# EAGLE design pocketbeagle_USB_hub_wifi (EAGLE 7.6.0)
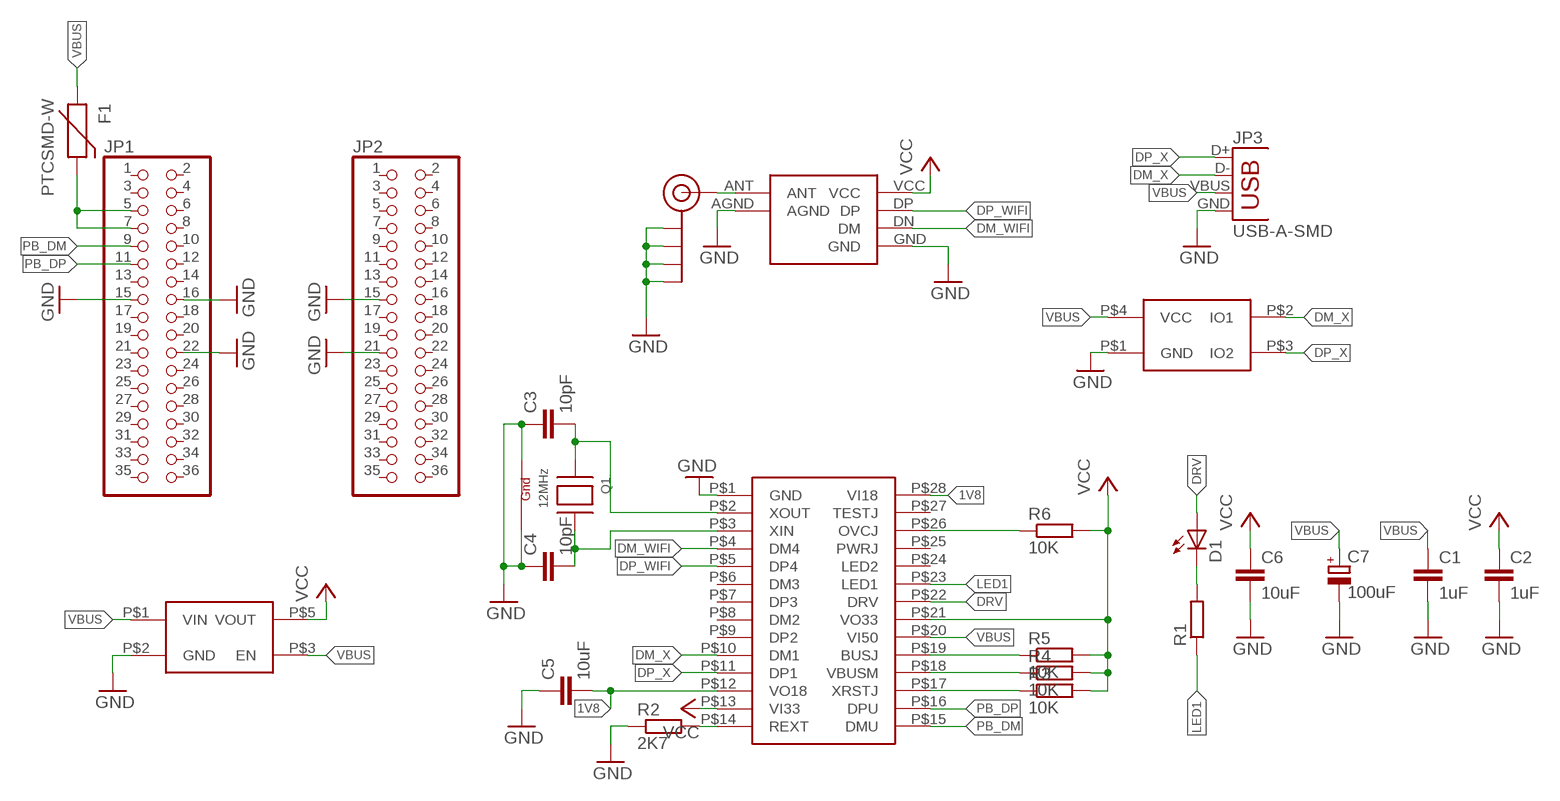
[diagram p0: schematic, sheet 1]

## Parts
C1  1uF  C-EUONEFITSALL  [ONEFITSALL]
C2  1uF  C-EUONEFITSALL  [ONEFITSALL]
C3  10pF  C-EUC0603  [C0603]
C4  10pF  C-EUC0603  [C0603]
C5  10uF  C-EUONEFITSALL  [ONEFITSALL]
C6  10uF  C-EUONEFITSALL  [ONEFITSALL]
C7  100uF  CPOL-EU153CLV-0605  [153CLV-0605]
D1  LEDCHIP-LED0603  [CHIP-LED0603]
F1  PTCSMD-W  [PTC-1206-WIDE]
J$1  SMA_EDGE  [SMA-EDGE]
JP1  PINHD-2X18  [2X18]
JP2  PINHD-2X18  [2X18]
JP3  USB-A-SMD  [USB-A-S-NOSILK-FEMALE]
Q1  12MHz  XTAL-4-3225  [NX3225]
R1  R-EU_R0603  [R0603]
R2  2K7  R-EU_R0603  [R0603]
R3  10K  R-EU_R0603  [R0603]
R4  10K  R-EU_R0603  [R0603]
R5  10K  R-EU_R0603  [R0603]
R6  10K  R-EU_R0603  [R0603]
U$1  RTL8188MODULE  [RTL8188]
U$2  FE1.1SSSOP28  [FE1.1S]
U$3  AP2112KAP2112K  [AP2112]
U$5  PRTR5V0U2X  [PRTR5V0U2X]

## Nets
1V8: C5.P$2 U$2.P$12(VO18) U$2.P$28(VI18)
DM_WIFI: U$1.DN(DM) U$2.P$4(DM4)
DM_X: JP3.D- U$2.P$10(DM1) U$5.P$2(IO1)
DP_WIFI: U$1.DP U$2.P$5(DP4)
DP_X: JP3.D+ U$2.P$11(DP1) U$5.P$3(IO2)
DRV: D1.A U$2.P$22(DRV)
GND: C1.P$2 C2.P$2 C3.1 C4.1 C5.P$1 C6.P$2 C7.- J$1.GND@0(GND) J$1.GND@1(GND) J$1.GND@2(GND) J$1.GND@3(GND) JP1.15 JP1.16 JP1.22 JP2.15 JP2.21 JP3.GND Q1.2(G2) Q1.4(G1) R2.1 U$1.AGND U$1.GND U$2.P$1(GND) U$3.P$2(GND) U$5.P$1(GND)
LED1: R1.1 U$2.P$23(LED1)
N$1: J$1.SIG(SIGNAL) U$1.ANT
N$2: D1.C R1.2
N$3: R3.1 U$2.P$17(XRSTJ)
N$4: C3.2 Q1.1(X1) U$2.P$2(XOUT)
N$5: R4.1 U$2.P$18(VBUSM)
N$6: C4.2 Q1.3(X2) U$2.P$3(XIN)
N$7: R2.2 U$2.P$14(REXT)
N$8: R5.1 U$2.P$19(BUSJ)
N$10: R6.1 U$2.P$26(OVCJ)
PB_DM: JP1.9 U$2.P$15(DMU)
PB_DP: JP1.11 U$2.P$16(DPU)
PB_VBUS: F1.2 JP1.5 JP1.7
VBUS: C1.P$1 C7.+ F1.1 JP3.VBUS U$2.P$20(VI50) U$3.P$1(VIN) U$3.P$3(EN) U$5.P$4(VCC)
VCC: C2.P$1 C6.P$1 R3.2 R4.2 R5.2 R6.2 U$1.VCC U$2.P$13(VI33) U$2.P$21(VO33) U$3.P$5(VOUT)
Unconnected: JP1.1 JP1.2 JP1.3 JP1.4 JP1.6 JP1.8 JP1.10 JP1.12 JP1.13 JP1.14 JP1.17 JP1.18 JP1.19 JP1.20 JP1.21 JP1.23 JP1.24 JP1.25 JP1.26 JP1.27 JP1.28 JP1.29 JP1.30 JP1.31 JP1.32 JP1.33 JP1.34 JP1.35 JP1.36 JP2.1 JP2.2 JP2.3 JP2.4 JP2.5 JP2.6 JP2.7 JP2.8 JP2.9 JP2.10 JP2.11 JP2.12 JP2.13 JP2.14 JP2.16 JP2.17 JP2.18 JP2.19 JP2.20 JP2.22 JP2.23 JP2.24 JP2.25 JP2.26 JP2.27 JP2.28 JP2.29 JP2.30 JP2.31 JP2.32 JP2.33 JP2.34 JP2.35 JP2.36 U$2.P$6(DM3) U$2.P$7(DP3) U$2.P$8(DM2) U$2.P$9(DP2) U$2.P$24(LED2) U$2.P$25(PWRJ) U$2.P$27(TESTJ)

## Library data of the parts
C1-C6 = rcl:C-EU: CAPACITOR, European symbol
C7 = rcl:CPOL-EU: POLARIZED CAPACITOR, European symbol
D1 = led:LED: LED OSRAM: - CHIPLED LG R971, LG N971, LY N971, LG Q971, LY Q971, LO R971, LY R971 LH N974, LH R974 LS Q976, LO Q976, LY Q976 LO Q996 - Hyper CHIPLED LW Q18S LB Q993, LB Q99A, LB R99A - SideLED LS A670, LO A670, LY A670, LG A670, LP A670 LB A673, LV A673, LT A673, LW A673 LH A674 LY A675 LS A676, LA A676, LO A676, LY A676, LW A676 LS A679, LY A679, LG A679 - Hyper Micro SIDELED® LS Y876, LA Y876, LO Y876, LY Y876 LT Y87S - SmartLED LW L88C, LW L88S LB L89C, LB L89S, LG L890 LS L89K, LO L89K, LY L89K LS L896, LA L896, LO L896, LY L896 - TOPLED LS T670, LO T670, LY T670, LG T670, LP T670 LSG T670, LSP T670, LSY T670, LOP T670, LYG T670 LG T671, LOG T671, LSG T671 LB T673, LV T673, LT T673, LW T673 LH T674 LS T676, LA T676, LO T676, LY T676, LB T676, LH T676, LSB T676, LW T676 LB T67C, LV T67C, LT T67C, LS T67K, LO T67K, LY T67K, LW E67C LS E67B, LA E67B, LO E67B, LY E67B, LB E67C, LV E67C, LT E67C LW T67C LS T679, LY T679, LG T679 LS T770, LO T770, LY T770, LG T770, LP T770 LB T773, LV T773, LT T773, LW T773 LH T774 LS E675, LA E675, LY E675, LS T675 LS T776, LA T776, LO T776, LY T776, LB T776 LHGB T686 LT T68C, LB T68C - Hyper Mini TOPLED® LB M676 - Mini TOPLED Santana® LG M470 LS M47K, LO M47K, LY M47K Source: http://www.osram.convergy.de LUXEON: - LUMILED® LXK2-PW12-R00, LXK2-PW12-S00, LXK2-PW14-U00, LXK2-PW14-V00 LXK2-PM12-R00, LXK2-PM12-S00, LXK2-PM14-U00 LXK2-PE12-Q00, LXK2-PE12-R00, LXK2-PE12-S00, LXK2-PE14-T00, LXK2-PE14-U00 LXK2-PB12-K00, LXK2-PB12-L00, LXK2-PB12-M00, LXK2-PB14-N00, LXK2-PB14-P00, LXK2-PB14-Q00 LXK2-PR12-L00, LXK2-PR12-M00, LXK2-PR14-Q00, LXK2-PR14-R00 LXK2-PD12-Q00, LXK2-PD12-R00, LXK2-PD12-S00 LXK2-PH12-R00, LXK2-PH12-S00 LXK2-PL12-P00, LXK2-PL12-Q00, LXK2-PL12-R00 Source: www.luxeon.com KINGBRIGHT: KA-3528ASYC Source: www.kingbright.com
F1 = SparkFun-PowerIC:PTC: Resettable Fuse PTC Resettable Fuse. Spark Fun Electronics SKU : COM-08357
J$1 = SparkFun-Connectors:SMA_EDGE: SMA Antenna Connector End launch SMA connector. The paste layer has been removed so that the connector can be hand soldered onto the board after reflow.
JP1 JP2 = pinhead:PINHD-2X18: PIN HEADER
JP3 = SparkFun-Connectors:USB: USB Connectors USB-B-PTH is fully proven SKU : PRT-00139/CONN-08278 USB-miniB is fully proven SKU : PRT-00587 USB-A-PCB is untested. USB-A-H is throughly reviewed, but untested. Spark Fun Electronics SKU : PRT-00437 USB-B-SMT is throughly reviewed, but untested. Needs silkscreen touching up. USB-A-S has not been used/tested USB-MB-H has not been used/tested USB-MICROB has been used. CONN-09505; PROD_ID: CONN-09520
Q1 = adafruit:XTAL-4: Classic 4-pin 3.2 x 2.5mm crystal
R1-R6 = rcl:R-EU_: RESISTOR, European symbol
U$1 = diy-modules:RTL8188
U$2 = pocketbeagle:FE1.1S
U$3 = TPS2113:AP2112K
U$5 = pocketbeagle:PRTR5V0U2X

## Board
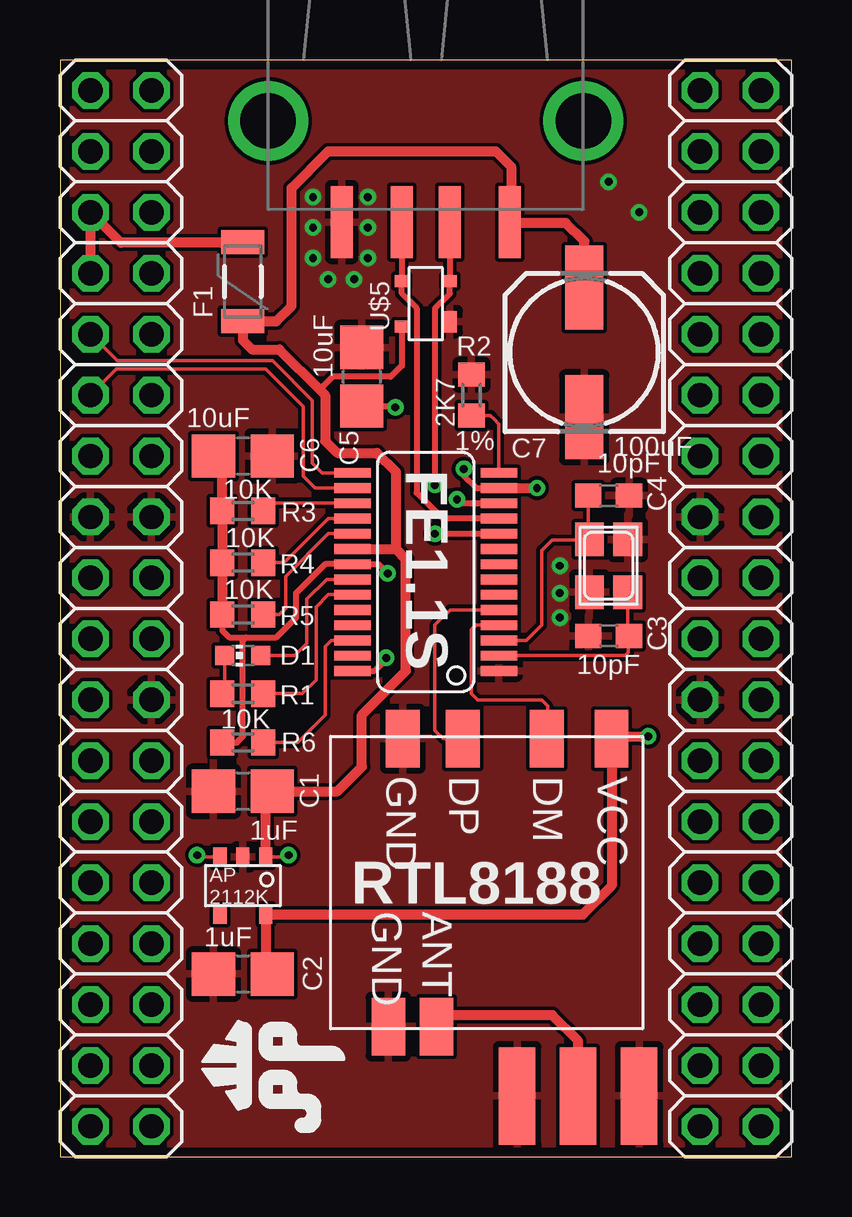
[diagram p1: board, top side]
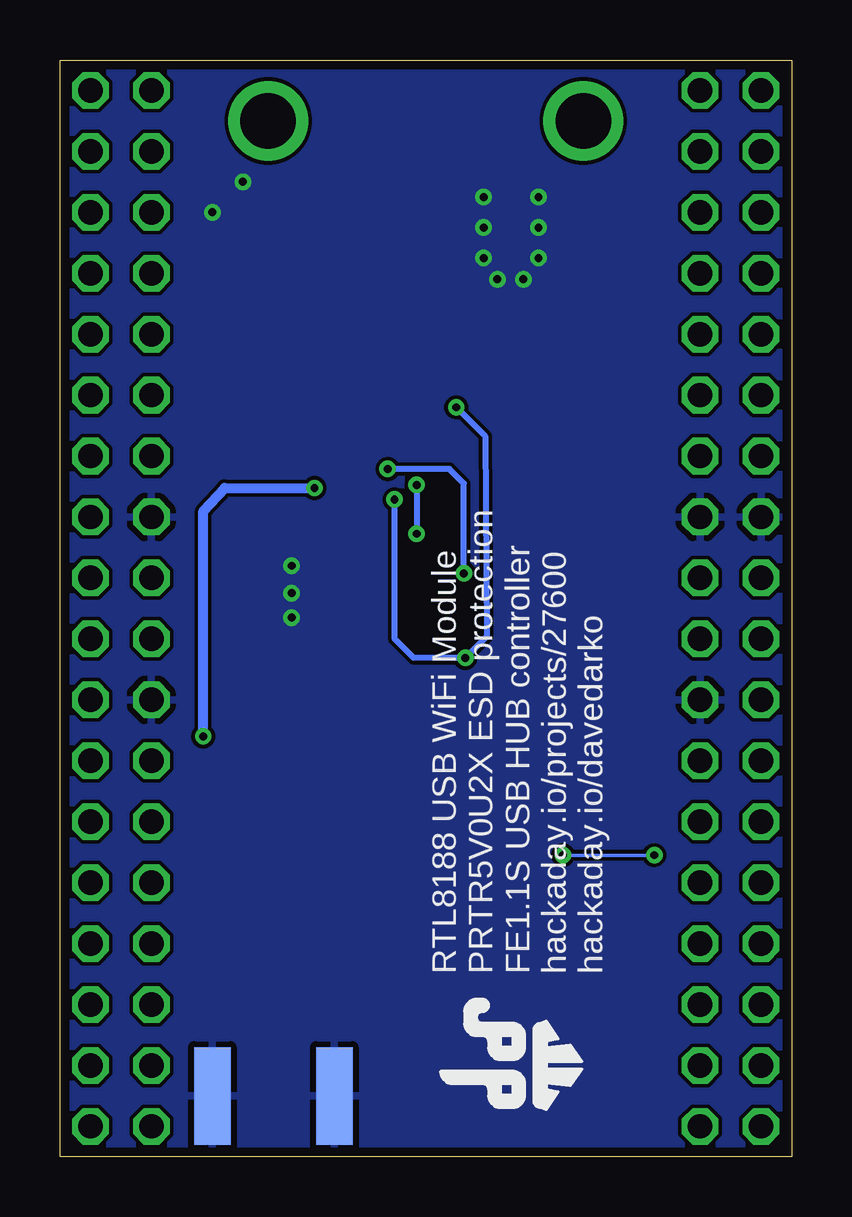
[diagram p2: board, bottom side, seen from below]

Size 30.48 x 45.72 mm. Coordinates in mm from the lower left corner, seen from the top.
Outline: 0,45.72 0,0 30.48,0 30.48,45.72 0,45.72
Copper layers (1*16): Top 0.0356mm / dielectric 1.5011mm / Bottom 0.0356mm
Design rules "LaenPCBOrder *": minimum track width 6mil, minimum drill 13mil, track to track 6mil, track to pad 6mil, pad to pad 6mil, via to via 6mil, smd to smd 6mil, copper to edge 15mil, drill to drill 6mil, minimum pad ring 7mil, minimum via ring 7mil, stop-mask expansion 3mil, vias tented up to drill 200mil, thermal gap 10mil

### Footprints (pad centres in the part's own frame; a part is rotated, then mirrored left to right if it is on the bottom)
ONEFITSALL = smd 1.8 x 1.8: P$1 -1.225,0; P$2 1.225,0
C0603 = smd 1.1 x 1: 1 -0.85,0; 2 0.85,0
153CLV-0605 = smd 3.5 x 1.6: + 2.7,0; - -2.7,0
CHIP-LED0603 = smd 0.8 x 0.8: A 0,-0.75; C 0,0.75
PTC-1206-WIDE = smd 1 x 1.8: 1 -1.654,0; 2 1.654,0
SMA-EDGE = smd 1.524 x 4.064: GND@0 0,0; GND@1 5.08,0; SIG 2.54,0 | smd 1.524 x 4.064 bottom: GND@2 0,0; GND@3 5.08,0
2X18 = drill 1.016 octagon: 1 -21.59,-1.27; 2 -21.59,1.27; 3 -19.05,-1.27; 4 -19.05,1.27; 5 -16.51,-1.27; 6 -16.51,1.27; 7 -13.97,-1.27; 8 -13.97,1.27; 9 -11.43,-1.27; 10 -11.43,1.27; 11 -8.89,-1.27; 12 -8.89,1.27; 13 -6.35,-1.27; 14 -6.35,1.27; 15 -3.81,-1.27; 16 -3.81,1.27; 17 -1.27,-1.27; 18 -1.27,1.27; 19 1.27,-1.27; 20 1.27,1.27; 21 3.81,-1.27; 22 3.81,1.27; 23 6.35,-1.27; 24 6.35,1.27; 25 8.89,-1.27; 26 8.89,1.27; 27 11.43,-1.27; 28 11.43,1.27; 29 13.97,-1.27; 30 13.97,1.27; 31 16.51,-1.27; 32 16.51,1.27; 33 19.05,-1.27; 34 19.05,1.27; 35 21.59,-1.27; 36 21.59,1.27
USB-A-S-NOSILK-FEMALE = smd 3 x 0.9: D+ 4.212,-1; D- 4.212,1; GND 4.212,-3.5; VBUS 4.212,3.5 | drill 2.311: S1 0,-6.566; S2 0,6.566
NX3225 = smd 1.4 x 1.2: 1 -1.1,-0.8; 2 1.1,-0.8; 3 1.1,0.8; 4 -1.1,0.8
R0603 = smd 1 x 1.1: 1 -0.85,0; 2 0.85,0
RTL8188 = smd 2.4 x 1.4: AGND 6,-4.1; ANT 6,-2.1; DN -6,2.5; DP -6,-1; GND -6,-3.5; VCC -6,5.2
FE1.1S = smd 1.524 x 0.406: P$1 -3.048,4.128; P$2 -3.048,3.493; P$3 -3.048,2.857; P$4 -3.048,2.223; P$5 -3.048,1.587; P$6 -3.048,0.953; P$7 -3.048,0.318; P$8 -3.048,-0.318; P$9 -3.048,-0.953; P$10 -3.048,-1.587; P$11 -3.048,-2.223; P$12 -3.048,-2.857; P$13 -3.048,-3.493; P$14 -3.048,-4.128; P$15 3.048,-4.128; P$16 3.048,-3.493; P$17 3.048,-2.857; P$18 3.048,-2.223; P$19 3.048,-1.587; P$20 3.048,-0.953; P$21 3.048,-0.318; P$22 3.048,0.318; P$23 3.048,0.953; P$24 3.048,1.587; P$25 3.048,2.223; P$26 3.048,2.857; P$27 3.048,3.493; P$28 3.048,4.128
AP2112 = smd 0.55 x 0.8: P$1 0.95,1.2; P$2 0,1.2; P$3 -0.95,1.2; P$4 -0.95,-1.2; P$5 0.95,-1.2
PRTR5V0U2X = smd 0.9 x 0.6: P$1 -0.75,-1 | smd 0.5 x 0.6: P$2 0.95,-1; P$3 0.95,1; P$4 -0.95,1

### Placement (x,y rotation side)
C1  7.62,15.24 180 top
C2  7.62,7.62 180 top
C3  22.86,21.72 0 top
C4  22.86,27.56 180 top
C5  12.57,32.51 270 top
C6  7.62,29.21 0 top
C7  21.84,33.53 90 top
D1  7.62,20.89 90 top
F1  7.62,36.48 90 top
J$1  24.13,2.54 180 top
JP1  2.54,22.86 270 top
JP2  27.94,22.86 270 top
JP3  15.24,43.18 270 top
Q1  22.86,24.64 90 top
R1  7.62,19.3 180 top
R2  17.14,31.75 270 top
R3  7.62,26.92 180 top
R4  7.62,24.77 180 top
R5  7.62,22.61 180 top
R6  7.62,17.27 180 top
U$1  17.78,11.43 270 top
U$2  15.24,24.38 180 top
U$3  7.62,11.3 0 top
U$4  [DAVEDARKO2_LOGO]  8.13,3.81 270 top
U$5  15.24,35.56 90 top
U$6  [DAVEDARKO2_LOGO]  10.92,3.81 90 bottom

### Tracks (layer width: path | path; a pad name or v marks a point on that pad's centre or on a via)
1V8  (via drill 0.33)
  Top 0.254: U$2.P$28 13.11,20.26 13.59,20.73 v13.59,20.8 | v16.54,27.4 16.7,27.24 U$2.P$12 | C5.P$2 13.93,31.29 v13.97,31.24
  Bottom 0.254: v16.54,27.4 16.54,21.59 15.75,20.8 v13.59,20.8 12.7,21.68 12.76,30.04 v13.97,31.24
DM_WIFI
  Top 0.152: U$2.P$4 17.34,22.16 17.14,21.97 17.14,19.3 17.4,19.05 20.07,19.05 20.32,18.8 20.32,17.47 U$1.DN
DM_X  (via drill 0.33)
  Top 0.254: v15.62,28 15.62,35.37 16.24,35.99 U$5.P$2 JP3.D- | v15.62,25.97 U$2.P$10
  Bottom 0.254: v15.62,28 v15.62,25.97
DP_WIFI
  Top 0.152: U$2.P$5 16.26,22.8 15.62,22.16 15.62,17.78 15.97,17.43 U$1.DP
DP_X
  Top 0.254: U$2.P$11 15.94,26.61 14.86,27.69 14.86,35.37 14.24,35.99 U$5.P$3 JP3.D+
DRV
  Top 0.152: D1.A 9.78,20.89 10.29,21.4 10.29,23.24 11.11,24.07 U$2.P$22
GND  (via drill 0.33)
  other vias: 20.83,24.64 20.83,23.5 20.83,22.48 10.54,40.01 12.83,40.01 12.83,38.73 12.83,37.47 10.54,38.73 10.54,37.47 11.18,36.58 12.26,36.58 22.86,40.64 24.13,39.37
  pour Top (isolate 0.152): -5.08,48.26 35.56,48.26 35.56,-2.54 -5.08,-2.54
  pour Bottom (isolate 0.152): -2.54,50.8 33.02,50.8 33.02,-5.08 -2.54,-5.08
LED1
  Top 0.152: U$2.P$23 11.18,23.43 10.67,22.92 10.67,19.88 10.1,19.3 R1.1
N$1
  Top 0.406: J$1.SIG 21.59,4.83 20.51,5.91 16.16,5.91 U$1.ANT
N$2
  Top 0.152: D1.C 6.87,19.4 R1.2
N$3
  Top 0.152: U$2.P$17 8.79,27.24 R3.1
N$4
  Top 0.152: Q1.1 23.66,21.77 C3.2 23.69,21.69 23.69,21.02 23.56,20.89 U$2.P$2
N$5
  Top 0.152: R4.1 9.34,24.77 11.18,26.61 U$2.P$18
N$6
  Top 0.152: C4.2 22.01,25.79 Q1.3 22.04,25.72 20.51,25.72 20.07,25.27 20.07,22.16 19.43,21.53 U$2.P$3
N$7
  Top 0.152: U$2.P$14 18.29,30.54 18.07,30.77 17.97,30.86 17.93,30.9 R2.2
N$8
  Top 0.152: R5.1 9.14,22.61 9.4,22.86 9.4,24.19 11.18,25.97 U$2.P$19
N$10
  Top 0.152: R6.1 9.91,17.27 11.05,18.41 11.05,21.27 11.3,21.53 U$2.P$26
PB_DM
  Top 0.152: JP1.9 2.38,33.18 8.86,33.18 10.51,31.53 10.51,28.92 10.92,28.51 U$2.P$15
PB_DP
  Top 0.152: JP1.11 2.35,32.83 8.57,32.83 10.13,31.27 10.13,28.38 10.64,27.88 U$2.P$16
PB_VBUS
  Top 0.406: JP1.7 JP1.5 2.54,38.1 6.73,38.1 F1.2
VBUS  (via drill 0.33)
  Top 0.152: U$3.P$3 5.79,12.5 v5.71,12.57 | v9.53,12.57 9.46,12.5 U$3.P$1
  Top 0.254: U$5.P$4 14.24,32.97 13.78,32.51 11.37,32.51 10.83,31.97
  Top 0.406: U$3.P$1 8.57,14.96 C1.P$1 11.56,15.24 12.57,16.26 12.57,18.41 14.41,20.26 14.41,24.92 14,25.34 | 12.13,25.34 U$2.P$20 14,25.34 | 14,25.34 14,28.54 13.21,29.34 11.56,29.34 11.05,29.84 11.05,31.75 10.83,31.97 9.14,33.66 8,33.66 7.62,34.04 F1.1 9.01,34.83 9.65,35.47 9.65,40.39 11.18,41.91 18.16,41.91 18.8,41.27 18.8,39.02 JP3.VBUS 18.78,38.92 21.08,38.92 21.84,38.16 C7.+
  Bottom 0.152: v5.71,12.57 v9.53,12.57
VCC  (via drill 0.33)
  Top 0.254: R5.2 6.77,21.93 7.05,21.65 7.75,21.65 | 7.75,21.65 9.02,21.65 9.84,22.48 9.84,23.5 11.05,24.7 U$2.P$21 13.27,24.7 v13.65,24.32 | R6.2 7.37,17.27 7.62,17.53 7.62,21.53 7.75,21.65 | v16.83,28.67 16.83,28.38 17.34,27.88 U$2.P$13
  Top 0.406: C2.P$1 8.57,7.89 U$3.P$5 21.79,10.1 22.98,11.3 U$1.VCC 23.08,17.53 v24.51,17.53 | U$2.P$13 v19.88,27.88 | C6.P$1 6.77,28.84 R3.2 R4.2 R5.2
  Bottom 0.254: v13.65,24.32 13.65,28.07 14.26,28.67 v16.83,28.67
  Bottom 0.406: v24.51,17.53 24.51,26.92 23.62,27.88 v19.88,27.88

### Text on the board
tNames: FE1.1S | 1% | RTL8188
bNames: RTL8188 USB WiFi Module / PRTR5V0U2X ESD protection / FE1.1S USB HUB controller / hackaday.io/projects/27600 / hackaday.io/davedarko